# Altium project pfc-control-board.PrjPcb
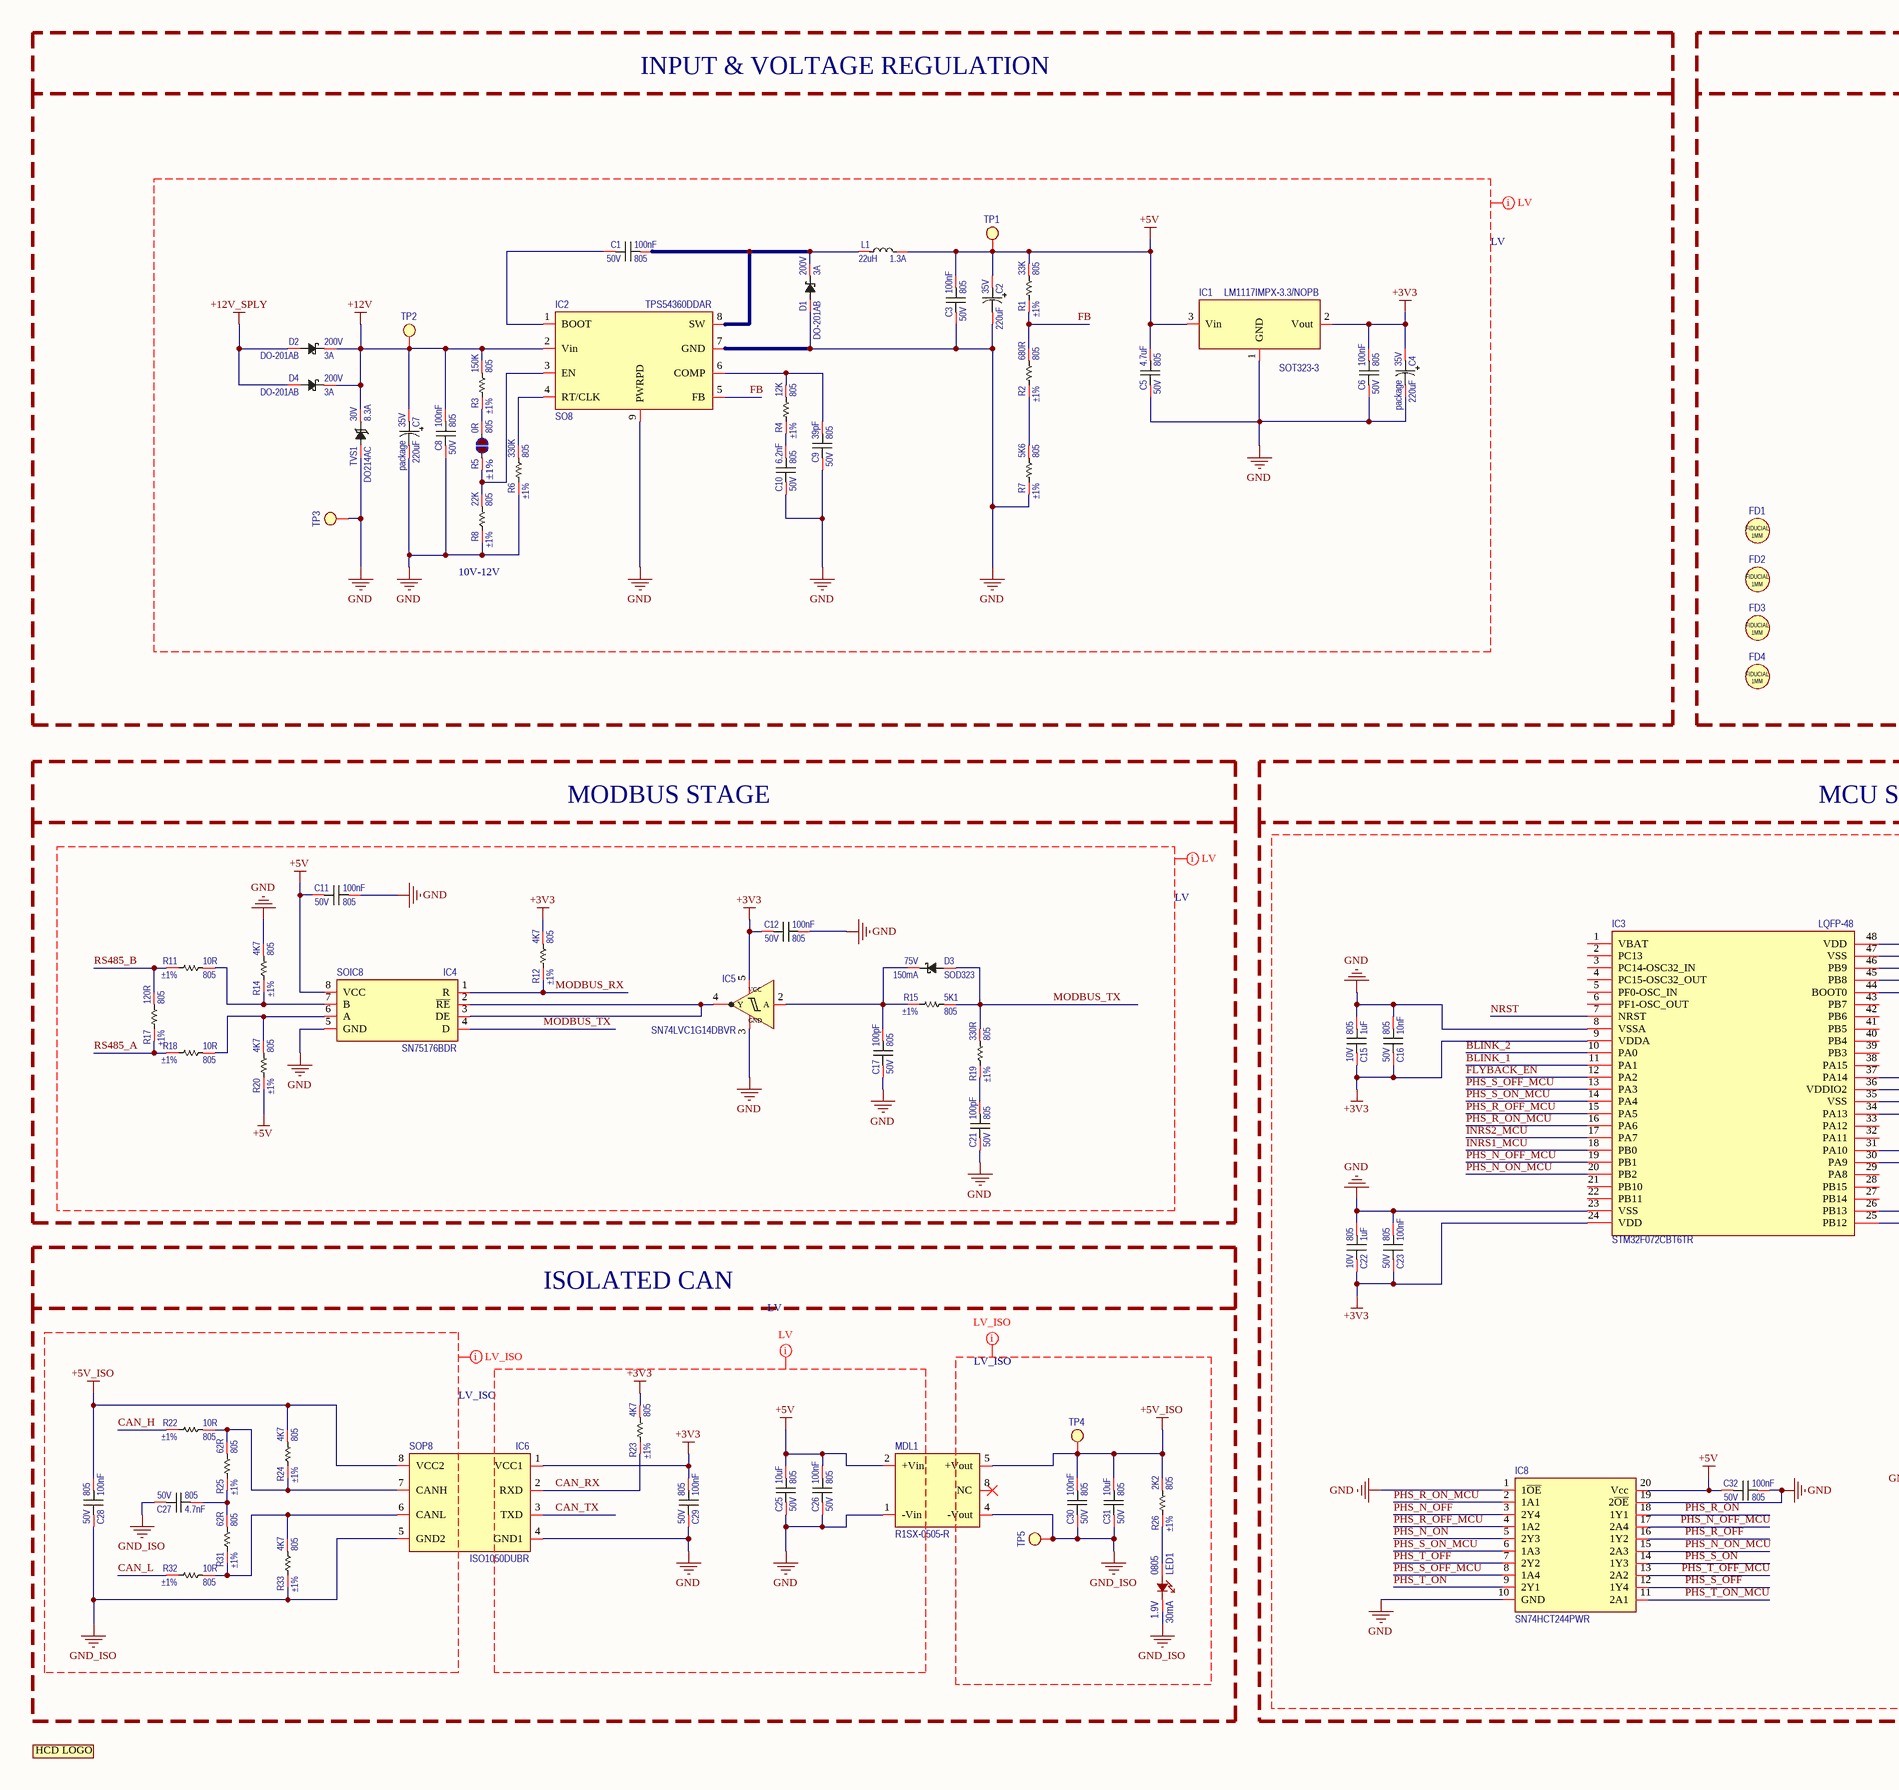
[diagram p0: pfc-control-board.SchDoc, left]
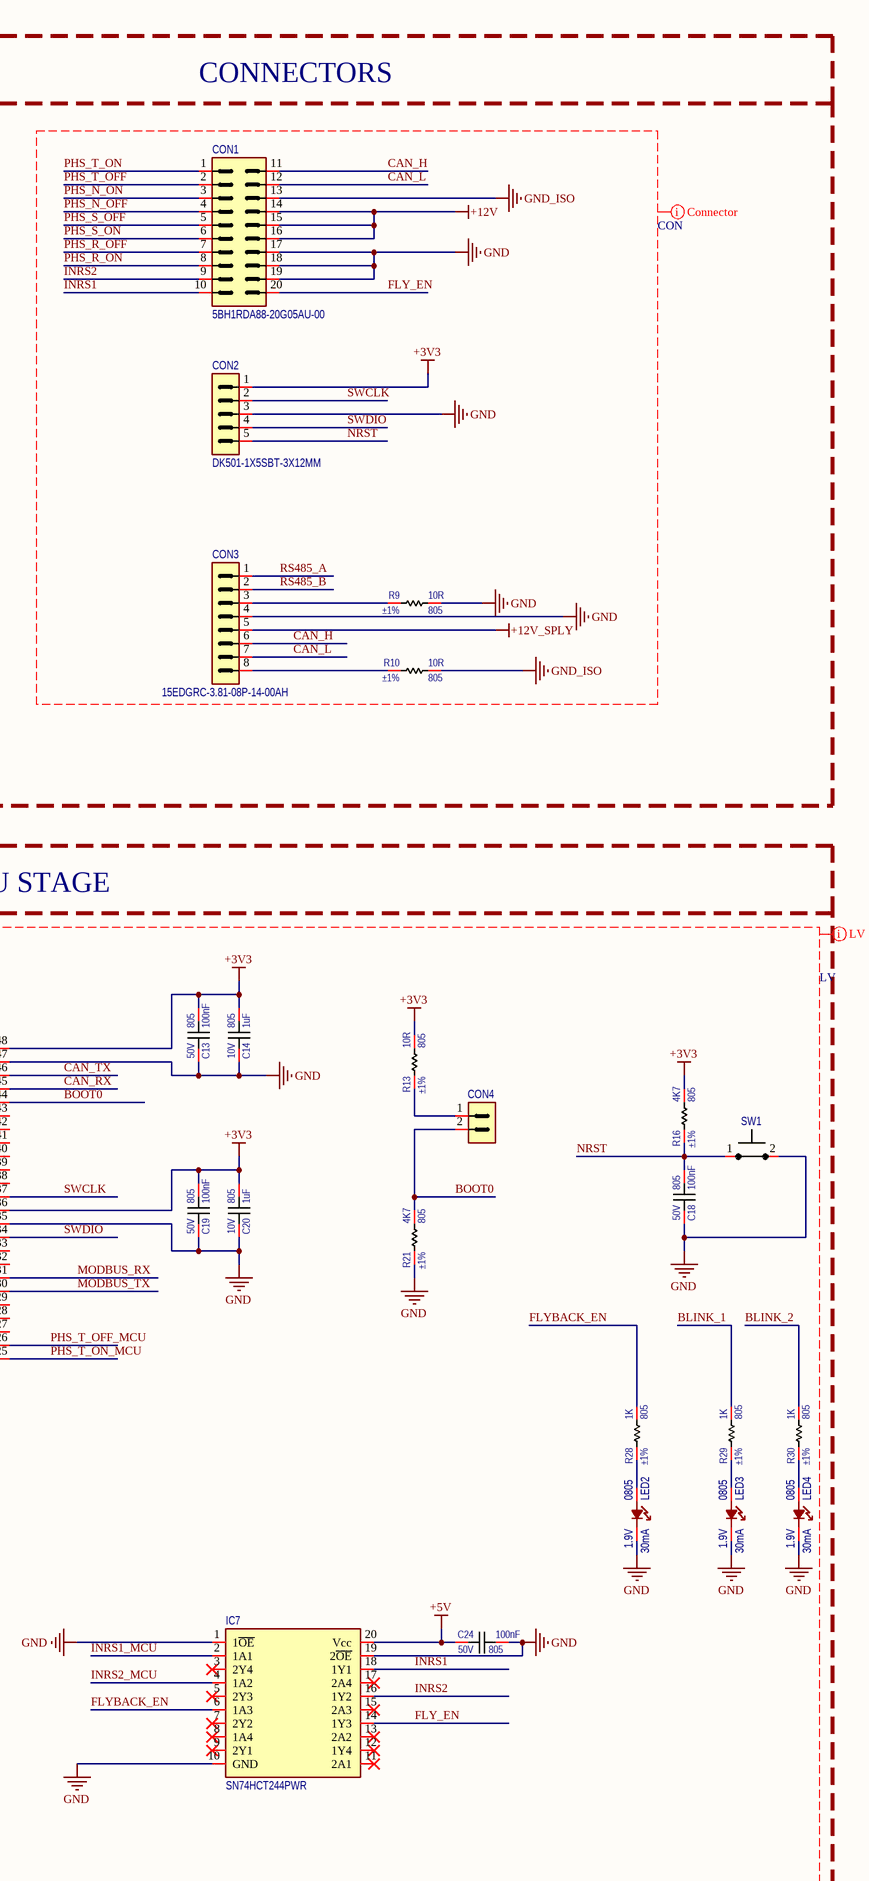
[diagram p1: pfc-control-board.SchDoc, right]
1 sheet, 98 parts. Net scope: global (net labels, ports and power ports of the same name join across sheets).
Board file: pfc-control-board.PcbDoc

## Sheet pfc-control-board.SchDoc
size A2; SheetNumber: 1; SheetTotal: 1

### Parts
C1  value 100nF  Voltage: 50V  Package: 805  [C_0805_L]  (hidden comment: StandardCapacitor)
C2  value 220uF  Voltage: 35V  [C_BDS35VC220MH10TP]  (hidden comment: PolarizedCapacitor)
C3  value 100nF  Voltage: 50V  Package: 805  [C_0805_L]  (hidden comment: StandardCapacitor)
C4  value 220uF  Voltage: 35V  [C_BDS35VC220MH10TP]  (hidden comment: PolarizedCapacitor)
C5  value 4.7uF  Voltage: 50V  Package: 805  [C_0805_L]  (hidden comment: StandardCapacitor)
C6  value 100nF  Voltage: 50V  Package: 805  [C_0805_L]  (hidden comment: StandardCapacitor)
C7  value 220uF  Voltage: 35V  [C_BDS35VC220MH10TP]  (hidden comment: PolarizedCapacitor)
C8  value 100nF  Voltage: 50V  Package: 805  [C_0805_L]  (hidden comment: StandardCapacitor)
C9  value 39pF  Voltage: 50V  Package: 805  [C_0805_L]  (hidden comment: StandardCapacitor)
C10  value 6.2nF  Voltage: 50V  Package: 805  [C_0805_L]  (hidden comment: StandardCapacitor)
C11  value 100nF  Voltage: 50V  Package: 805  [C_0805_L]  (hidden comment: StandardCapacitor)
C12  value 100nF  Voltage: 50V  Package: 805  [C_0805_L]  (hidden comment: StandardCapacitor)
C13  value 100nF  Voltage: 50V  Package: 805  [C_0805_L]  (hidden comment: StandardCapacitor)
C14  value 1uF  Voltage: 10V  Package: 805  [C_0805_L]  (hidden comment: StandardCapacitor)
C15  value 1uF  Voltage: 10V  Package: 805  [C_0805_L]  (hidden comment: StandardCapacitor)
C16  value 10nF  Voltage: 50V  Package: 805  [C_0805_L]  (hidden comment: StandardCapacitor)
C17  value 100pF  Voltage: 50V  Package: 805  [C_0805_L]  (hidden comment: StandardCapacitor)
C18  value 100nF  Voltage: 50V  Package: 805  [C_0805_L]  (hidden comment: StandardCapacitor)
C19  value 100nF  Voltage: 50V  Package: 805  [C_0805_L]  (hidden comment: StandardCapacitor)
C20  value 1uF  Voltage: 10V  Package: 805  [C_0805_L]  (hidden comment: StandardCapacitor)
C21  value 100pF  Voltage: 50V  Package: 805  [C_0805_L]  (hidden comment: StandardCapacitor)
C22  value 1uF  Voltage: 10V  Package: 805  [C_0805_L]  (hidden comment: StandardCapacitor)
C23  value 100nF  Voltage: 50V  Package: 805  [C_0805_L]  (hidden comment: StandardCapacitor)
C24  value 100nF  Voltage: 50V  Package: 805  [C_0805_L]  (hidden comment: StandardCapacitor)
C25  value 10uF  Voltage: 50V  Package: 805  [C_0805_L]  (hidden comment: StandardCapacitor)
C26  value 100nF  Voltage: 50V  Package: 805  [C_0805_L]  (hidden comment: StandardCapacitor)
C27  value 4.7nF  Voltage: 50V  Package: 805  [C_0805_L]  (hidden comment: StandardCapacitor)
C28  value 100nF  Voltage: 50V  Package: 805  [C_0805_L]  (hidden comment: StandardCapacitor)
C29  value 100nF  Voltage: 50V  Package: 805  [C_0805_L]  (hidden comment: StandardCapacitor)
C30  value 100nF  Voltage: 50V  Package: 805  [C_0805_L]  (hidden comment: StandardCapacitor)
C31  value 10uF  Voltage: 50V  Package: 805  [C_0805_L]  (hidden comment: StandardCapacitor)
C32  value 100nF  Voltage: 50V  Package: 805  [C_0805_L]  (hidden comment: StandardCapacitor)
CON1  Manufacturer PN: 5BH1RDA88-20G05AU-00  [male-thd-box-header-2x10-2.54mm-90D_AMTEK]  (hidden comment: CON_20POS_2R)
CON2  Manufacturer PN: DK501-1X5SBT-3X12MM  [male-thd-1x5-pin-header-2.54mm-180D]  (hidden comment: CON_5POS_1R)
CON3  Manufacturer PN: 15EDGRC-3.81-08P-14-00AH  [CON_15EDGRC-3.81-08P-14-00AH]  (hidden comment: CON_8POS_1R)
CON4  CON_2POS_1R  [male-thd-1x2-pin-header-2.54mm-90D]  (value not drawn)
D1  Voltage: 200V  Current: 3A  Package: DO-201AB  [D_DO214AB_ONSEMI]  (hidden comment: SchDiode_A1C2)
D2  Voltage: 200V  Current: 3A  Package: DO-201AB  [D_DO214AB_ONSEMI]  (hidden comment: SchDiode_A1C2)
D3  Voltage: 75V  Current: 150mA  Package: SOD323  [D_SOD323_HOTTECH]  (hidden comment: SchDiode_A1C2)
D4  Voltage: 200V  Current: 3A  Package: DO-201AB  [D_DO214AB_ONSEMI]  (hidden comment: SchDiode_A1C2)
FD1  (no value)  [FIDUCIAL_1MM]
FD2  (no value)  [FIDUCIAL_1MM]
FD3  (no value)  [FIDUCIAL_1MM]
FD4  (no value)  [FIDUCIAL_1MM]
IC1  Manufacturer PN: LM1117IMPX-3.3/NOPB  package: SOT323-3  [IC_SOT223_TEXAS]  (hidden comment: IC_LDO_LDL1117)
IC2  Manufacturer PN: TPS54360DDAR  Package: SO8  [IC_SO8_TEXAS]  (hidden comment: IC_SWREG_TPS54360DDAR)
IC3  Manufacturer PN: STM32F072CBT6TR  Package: LQFP-48  [IC_LQFP48_ST]  (hidden comment: IC_STM32F072CBT6TR)
IC4  Manufacturer PN: SN75176BDR  Package: SOIC8  [IC_SOIC8-D_TEXAS]  (hidden comment: IC_TR_SN75176BDR)
IC5  Manufacturer PN: SN74LVC1G14DBVR  [IC_SOT23-5_TEXAS]  (hidden comment: IC_BUF_NON_A2-3GND-4Y-5VCC)
IC6  Manufacturer PN: ISO1050DUBR  Package: SOP8  [IC_SOP8_TEXAS]  (hidden comment: IC_TR_ISO1050DUBR)
IC7  Manufacturer PN: SN74HCT244PWR  [IC_TSSOP20_TEXAS]  (hidden comment: IC_BUF_SN74HCT244PWR)
IC8  Manufacturer PN: SN74HCT244PWR  [IC_TSSOP20_TEXAS]  (hidden comment: IC_BUF_SN74HCT244PWR)
L1  value 22uH  Current: 1.3A  [IND_NR6028]  (hidden comment: StandardInductor)
LED1  Voltage: 1.9V  Current: 30mA  Package: 0805  [LED_0805]  (hidden comment: LED_RED)
LED2  Voltage: 1.9V  Current: 30mA  Package: 0805  [LED_0805]  (hidden comment: LED_RED)
LED3  Voltage: 1.9V  Current: 30mA  Package: 0805  [LED_0805]  (hidden comment: LED_RED)
LED4  Voltage: 1.9V  Current: 30mA  Package: 0805  [LED_0805]  (hidden comment: LED_RED)
LOGO1  HCD_LOGO  [HCD_LOGO_V1]  (value not drawn)  (no BOM)
MDL1  Manufacturer PN: R1SX-0505-R  [DCDC_R1SX-0505-R]  (hidden comment: DCDC_Module_Recom_R1SX)
R1  value 33K  Tolerance: ±1%  Package: 805  [R_0805_L]  (hidden comment: StandardResistor)
R2  value 680R  Tolerance: ±1%  Package: 805  [R_0805_L]  (hidden comment: StandardResistor)
R3  value 150K  Tolerance: ±1%  Package: 805  [R_0805_L]  (hidden comment: StandardResistor)
R4  value 12K  Tolerance: ±1%  Package: 805  [R_0805_L]  (hidden comment: StandardResistor)
R5  value 0R  Tolerance: ±1%  Package: 805  [R_0805_L]  (hidden comment: Jumper)
R6  value 330K  Tolerance: ±1%  Package: 805  [R_0805_L]  (hidden comment: StandardResistor)
R7  value 5K6  Tolerance: ±1%  Package: 805  [R_0805_L]  (hidden comment: StandardResistor)
R8  value 22K  Tolerance: ±1%  Package: 805  [R_0805_L]  (hidden comment: StandardResistor)
R9  value 10R  Tolerance: ±1%  Package: 805  [R_0805_L]  (hidden comment: StandardResistor)
R10  value 10R  Tolerance: ±1%  Package: 805  [R_0805_L]  (hidden comment: StandardResistor)
R11  value 10R  Tolerance: ±1%  Package: 805  [R_0805_L]  (hidden comment: StandardResistor)
R12  value 4K7  Tolerance: ±1%  Package: 805  [R_0805_L]  (hidden comment: StandardResistor)
R13  value 10R  Tolerance: ±1%  Package: 805  [R_0805_L]  (hidden comment: StandardResistor)
R14  value 4K7  Tolerance: ±1%  Package: 805  [R_0805_L]  (hidden comment: StandardResistor)
R15  value 5K1  Tolerance: ±1%  Package: 805  [R_0805_L]  (hidden comment: StandardResistor)
R16  value 4K7  Tolerance: ±1%  Package: 805  [R_0805_L]  (hidden comment: StandardResistor)
R17  value 120R  Tolerance: ±1%  Package: 805  [R_0805_L]  (hidden comment: StandardResistor)
R18  value 10R  Tolerance: ±1%  Package: 805  [R_0805_L]  (hidden comment: StandardResistor)
R19  value 330R  Tolerance: ±1%  Package: 805  [R_0805_L]  (hidden comment: StandardResistor)
R20  value 4K7  Tolerance: ±1%  Package: 805  [R_0805_L]  (hidden comment: StandardResistor)
R21  value 4K7  Tolerance: ±1%  Package: 805  [R_0805_L]  (hidden comment: StandardResistor)
R22  value 10R  Tolerance: ±1%  Package: 805  [R_0805_L]  (hidden comment: StandardResistor)
R23  value 4K7  Tolerance: ±1%  Package: 805  [R_0805_L]  (hidden comment: StandardResistor)
R24  value 4K7  Tolerance: ±1%  Package: 805  [R_0805_L]  (hidden comment: StandardResistor)
R25  value 62R  Tolerance: ±1%  Package: 805  [R_0805_L]  (hidden comment: StandardResistor)
R26  value 2K2  Tolerance: ±1%  Package: 805  [R_0805_L]  (hidden comment: StandardResistor)
R28  value 1K  Tolerance: ±1%  Package: 805  [R_0805_L]  (hidden comment: StandardResistor)
R29  value 1K  Tolerance: ±1%  Package: 805  [R_0805_L]  (hidden comment: StandardResistor)
R30  value 1K  Tolerance: ±1%  Package: 805  [R_0805_L]  (hidden comment: StandardResistor)
R31  value 62R  Tolerance: ±1%  Package: 805  [R_0805_L]  (hidden comment: StandardResistor)
R32  value 10R  Tolerance: ±1%  Package: 805  [R_0805_L]  (hidden comment: StandardResistor)
R33  value 4K7  Tolerance: ±1%  Package: 805  [R_0805_L]  (hidden comment: StandardResistor)
SW1  BUTTON_2PIN  [BUTTON_DTSMF-31R-V_DIPTRONICS]  (value not drawn)
TP1  (no value)  [TP_SMD_CIRC_D1.0]
TP2  (no value)  [TP_SMD_CIRC_D1.0]
TP3  (no value)  [TP_SMD_CIRC_D1.0]
TP4  (no value)  [TP_SMD_CIRC_D1.0]
TP5  (no value)  [TP_SMD_CIRC_D1.0]
TVS1  Voltage: 30V  Current: 8.3A  Package: DO214AC  [TVS_SMA_PANJIT]  (hidden comment: TVSDiodeUnidir_A1C2)

### Blocks framed on the sheet
INPUT & VOLTAGE REGULATION: C1-C10 D1 D2 D4 IC1 IC2 L1 R1-R8 TP1-TP3 TVS1
CONNECTORS: CON1-CON3 FD1-FD4 R9 R10
MODBUS STAGE: C11 C12 C17 C21 D3 IC4 IC5 R11 R12 R14 R15 R17-R20
MCU STAGE: C13-C16 C18-C20 C22-C24 C32 CON4 IC3 IC7 IC8 LED2-LED4 R13 R16 R21 R28-R30 SW1
ISOLATED CAN: C25-C31 IC6 LED1 MDL1 R22-R26 R31-R33 TP4 TP5

### Nets
+3V3: C4.1 C6.2 C12.1 C13.2 C14.2 C15.1 C16.1 C19.2 C20.2 C22.1 C23.1 C29.2 CON2.1 IC1.2(Vout) IC3.9(VDDA) IC3.24(VDD) IC3.36(VDDIO2) IC3.48(VDD) IC5.5(VCC) IC6.1(VCC1) R12.2 R13.2 R16.2 R23.2
+5V: C2.1 C3.2 C5.2 C11.1 C24.1 C25.2 C26.2 C32.1 IC1.3(Vin) IC4.8(VCC) IC7.20(Vcc) IC8.20(Vcc) L1.2 MDL1.2(+Vin) R1.2 R20.1 TP1.1
+5V_ISO: C28.2 C30.2 C31.2 IC6.8(VCC2) MDL1.5(+Vout) R24.2 R26.2 TP4.1
+12V: C7.1 C8.2 CON1.14 CON1.15 CON1.16 D2.2(C) D4.2(C) IC2.2(Vin) R3.2 TP2.1 TVS1.2(C)
+12V_SPLY: CON3.5 D2.1(A) D4.1(A)
GND: C2.2 C3.1 C4.2 C5.1 C6.1 C7.2 C8.1 C9.1 C10.1 C11.2 C12.2 C13.1 C14.1 C15.2 C16.2 C17.1 C18.1 C19.1 C20.1 C21.1 C22.2 C23.2 C24.2 C25.1 C26.1 C29.1 C32.2 CON1.17 CON1.18 CON1.19 CON2.3 CON3.4 D1.1(A) IC1.1(GND) IC2.7(GND) IC2.9(PWRPD) IC3.8(VSSA) IC3.23(VSS) IC3.35(VSS) IC3.47(VSS) IC4.5(GND) IC5.3(GND) IC6.4(GND1) IC7.1(1~{OE}) IC7.10(GND) IC7.19(2~{OE}) IC8.1(1~{OE}) IC8.10(GND) IC8.19(2~{OE}) LED2.2(C) LED3.2(C) LED4.2(C) MDL1.1(-Vin) R6.1 R7.1 R8.1 R9.2 R14.2 R21.1 SW1.2 TP3.1 TVS1.1(A)
GND_ISO: C27.1 C28.1 C30.1 C31.1 CON1.13 IC6.5(GND2) LED1.2(C) MDL1.4(-Vout) R10.2 R33.1 TP5.1
BLINK_1: IC3.11(PA1) R29.2
BLINK_2: IC3.10(PA0) R30.2
BOOT0: CON4.2 IC3.44(BOOT0) R21.2
CAN_H: CON1.11 CON3.6 R22.1
CAN_L: CON1.12 CON3.7 R32.1
CAN_RX: IC3.45(PB8) IC6.2(RXD) R23.1
CAN_TX: IC3.46(PB9) IC6.3(TXD)
FB: IC2.5(FB) R1.1 R2.2
FLY_EN: CON1.20 IC7.14(1Y3)
FLYBACK_EN: IC3.12(PA2) IC7.6(1A3) R28.2
INRS1: CON1.10 IC7.18(1Y1)
INRS1_MCU: IC3.18(PB0) IC7.2(1A1)
INRS2: CON1.9 IC7.16(1Y2)
INRS2_MCU: IC3.17(PA7) IC7.4(1A2)
MODBUS_RX: IC3.31(PA10) IC4.1(R) R12.1
MODBUS_TX: D3.1(A) IC3.30(PA9) IC4.4(D) R15.2 R19.2
NRST: C18.2 CON2.5 IC3.7(NRST) R16.1 SW1.1
PHS_N_OFF: CON1.4 IC8.3(2Y4)
PHS_N_OFF_MCU: IC3.19(PB1) IC8.17(2A4)
PHS_N_ON: CON1.3 IC8.5(2Y3)
PHS_N_ON_MCU: IC3.20(PB2) IC8.15(2A3)
PHS_R_OFF: CON1.7 IC8.16(1Y2)
PHS_R_OFF_MCU: IC3.15(PA5) IC8.4(1A2)
PHS_R_ON: CON1.8 IC8.18(1Y1)
PHS_R_ON_MCU: IC3.16(PA6) IC8.2(1A1)
PHS_S_OFF: CON1.5 IC8.12(1Y4)
PHS_S_OFF_MCU: IC3.13(PA3) IC8.8(1A4)
PHS_S_ON: CON1.6 IC8.14(1Y3)
PHS_S_ON_MCU: IC3.14(PA4) IC8.6(1A3)
PHS_T_OFF: CON1.2 IC8.7(2Y2)
PHS_T_OFF_MCU: IC3.26(PB13) IC8.13(2A2)
PHS_T_ON: CON1.1 IC8.9(2Y1)
PHS_T_ON_MCU: IC3.25(PB12) IC8.11(2A1)
RS485_A: CON3.1 R17.1 R18.1
RS485_B: CON3.2 R11.1 R17.2
SWCLK: CON2.2 IC3.37(PA14)
SWDIO: CON2.4 IC3.34(PA13)
NetC1_1: C1.1 IC2.1(BOOT)
NetC1_2: C1.2 D1.2(C) IC2.8(SW) L1.1
NetC9_2: C9.2 IC2.6(COMP) R4.2
NetC10_2: C10.2 R4.1
NetC17_2: C17.2 D3.2(C) IC5.2(A) R15.1
NetC21_2: C21.2 R19.1
NetC27_2: C27.2 R25.1 R31.2
NetCON3_3: CON3.3 R9.1
NetCON3_8: CON3.8 R10.1
NetCON4_1: CON4.1 R13.1
NetIC2_3: IC2.3(EN) R5.1 R8.2
NetIC2_4: IC2.4(RT/CLK) R6.2
NetIC4_2: IC4.2(~{RE}) IC4.3(DE) IC5.4(Y)
NetIC4_6: IC4.6(A) R18.2 R20.2
NetIC4_7: IC4.7(B) R11.2 R14.1
NetIC6_6: IC6.6(CANL) R31.1 R32.2 R33.2
NetIC6_7: IC6.7(CANH) R22.2 R24.1 R25.2
NetLED1_1: LED1.1(A) R26.1
NetLED2_1: LED2.1(A) R28.1
NetLED3_1: LED3.1(A) R29.1
NetLED4_1: LED4.1(A) R30.1
NetR2_1: R2.1 R7.2
NetR3_1: R3.1 R5.2

Not connected (* = marked no-connect by the designer): IC3 1(VBAT) 2(PC13) 3(PC14-OSC32_IN) 4(PC15-OSC32_OUT) 5(PF0-OSC_IN) 6(PF1-OSC_OUT) 21(PB10) 22(PB11) 27(PB14) 28(PB15) 29(PA8) 32(PA11) 33(PA12) 38(PA15) 39(PB3) 40(PB4) 41(PB5) 42(PB6) 43(PB7); IC7 3(2Y4)* 5(2Y3)* 7(2Y2)* 8(1A4)* 9(2Y1)* 11(2A1)* 12(1Y4)* 13(2A2)* 15(2A3)* 17(2A4)*; MDL1 8(NC)*

### Layout directives
net class LV_ISO: +5V_ISO, CAN_H, CAN_L, GND_ISO
net class LV: +3V3, +5V, +12V, +12V_SPLY, BLINK_1, BLINK_2, BOOT0, CAN_RX, CAN_TX, FB, FLY_EN, FLYBACK_EN, GND, INRS1, INRS1_MCU, INRS2, INRS2_MCU, MODBUS_RX, MODBUS_TX, NRST, PHS_N_OFF, PHS_N_OFF_MCU, PHS_N_ON, PHS_N_ON_MCU, PHS_R_OFF, PHS_R_OFF_MCU, PHS_R_ON, PHS_R_ON_MCU, PHS_S_OFF, PHS_S_OFF_MCU, PHS_S_ON, PHS_S_ON_MCU, PHS_T_OFF, PHS_T_OFF_MCU, PHS_T_ON, PHS_T_ON_MCU, RS485_A, RS485_B, SWCLK, SWDIO
net class CON: +3V3, +12V, +12V_SPLY, CAN_H, CAN_L, FLY_EN, GND, GND_ISO, INRS1, INRS2, NRST, PHS_N_OFF, PHS_N_ON, PHS_R_OFF, PHS_R_ON, PHS_S_OFF, PHS_S_ON, PHS_T_OFF, PHS_T_ON, RS485_A, RS485_B, SWCLK, SWDIO

### Notes on the sheet
- (near R8) 10V-12V
- (in symbol 1MM_FIDUCIAL) FIDUCIAL; 1MM
- (in symbol HCD_LOGO_V1) HCD LOGO

### Library data of the parts
C1 C3 C6 C8 C11-C13 C18 C19 C23 C24 C26 C28-C30 C32 = CAP_CER_100nF_SMD_50V_±20%_0805: 0.1 µF ±20% 50V Ceramic Capacitor X7R 0805 (2012 Metric); Manufacturer: KEMET; Manufacturer PN: C0805C104M5RAC7800; Lead Status: ROHS3 Compliant; Temp# Operating: -55/+125°C; Max Reflow Duration: 10s; Max Reflow Temp: 260C; Identifier: CAP_CER_100nF_SMD_50V_±20%_0805; Component Type: Ceramic Capacitor; Distributor: Digikey; Tolerance: ±20%; MSL: 1; Features: X7R; Mounting Type: SMD; Status: Active; Height: 0.88mm; Cost: 0,1; Supplier URL: https://www.digikey.com/en/products/detail/kemet/C0805C104M5RAC7800/411168
C2 C4 C7 = CAP_ALUM_ELK_220uF_SMD_35V_±20%: CAP.EL.220uF 35V 8x10 105C 2000Hrs SMD; Manufacturer: SAMYOUNG; Manufacturer PN: BDS35VC220MH10TP; Tolerance: ±20%; Lead Status: ROHS3 Compliant; Temp# Operating: -40/+105°C; Max Reflow Duration: 10s; Max Reflow Temp: 260C; Identifier: CAP_ALUM_ELK_220uF_SMD_35V_±20%; Component Type: Aluminum Capacitor; Distributor: Özdisan; Status: Active; Height: 10mm; Cost: 0,14; MSL: 1; Mounting Type: SMD; Supplier URL: https://ozdisan.com/pasif-komponentler/kapasitorler/aluminyum-kapasitorler/BDS35VC220MH10TP/455406
  C4 C7: Package: package
C5 = CAP_CER_4.7uF_SMD_50V_±10%_0805: 4.7 µF ±10% 50V Ceramic Capacitor X7R 0805 (2012 Metric); Manufacturer: TDK Corporation; Manufacturer PN: C2012X7R1H475K125AC; Lead Status: ROHS3 Compliant; Temp# Operating: -55/+125°C; Max Reflow Duration: 10s; Max Reflow Temp: 260C; Identifier: CAP_CER_4.7uF_SMD_50V_±10%_0805; Component Type: Ceramic Capacitor; Distributor: Digikey; Tolerance: ±10%; MSL: 1; Features: X7R; Mounting Type: SMD; Status: Active; Height: 1.5mm; Cost: 0,54; Supplier URL: https://www.digikey.com/en/products/detail/tdk-corporation/C2012X7R1H475K125AC/10413507
C9 = CAP_CER_39pF_SMD_50V_±5%_0805: 39 pF ±5% 50V Ceramic Capacitor C0G, NP0 0805 (2012 Metric); Manufacturer: YAGEO; Manufacturer PN: CC0805JRNPO9BN390; Lead Status: ROHS3 Compliant; Temp# Operating: -55/+125°C; Max Reflow Duration: 10s; Max Reflow Temp: 260C; Identifier: CAP_CER_39pF_SMD_50V_±5%_0805; Component Type: Ceramic Capacitor; Distributor: Digikey; Tolerance: ±5%; MSL: 1; Features: General purpose; Mounting Type: SMD; Status: Active; Height: 2mm; Cost: 0,1; Supplier URL: https://www.digikey.com/en/products/detail/yageo/CC0805JRNPO9BN390/302840
C10 = CAP_CER_6.2nF_SMD_50V_±5%_0805: 6200 pF ±5% 50V Ceramic Capacitor C0G, NP0 0805 (2012 Metric); Manufacturer: KEMET; Manufacturer PN: C0805C622J5GACTU; Lead Status: ROHS3 Compliant; Temp# Operating: -55/+125°C; Max Reflow Duration: 10s; Max Reflow Temp: 260C; Identifier: CAP_CER_6.2nF_SMD_50V_±5%_0805; Component Type: Ceramic Capacitor; Distributor: Digikey; Status: Active; Tolerance: ±5%; Height: 0,88mm; Cost: 0,211; MSL: 1; Mounting Type: SMD; Features: Low ESL, general purpose; Supplier URL: https://www.digikey.com/en/products/detail/kemet/C0805C622J5GACTU/7382176
C14 C15 C20 C22 = CAP_CER_1uF_SMD_10V_±10%_0805: 1 µF ±10% 10V Ceramic Capacitor X7R 0603 (1608 Metric); Manufacturer: Samsung Electro-Mechanics; Manufacturer PN: CL10B105KP8NNNC; Lead Status: ROHS3 Compliant; Temp# Operating: -55/+125°C; Max Reflow Duration: 10s; Max Reflow Temp: 260C; Identifier: CAP_CER_1uF_SMD_10V_±10%_0805; Component Type: Ceramic Capacitor; Distributor: Digikey; Tolerance: ±10%; MSL: 1; Features: X7R; Mounting Type: SMD; Status: Active; Height: 0.9mm; Cost: 0,1; Supplier URL: https://www.digikey.com/en/products/detail/samsung-electro-mechanics/CL10B105KP8NNNC/3887604
C16 = CAP_CER_10nF_SMD_50V_±5%_0805: 10000 pF ±5% 50V Ceramic Capacitor X7R 0805 (2012 Metric); Manufacturer: KEMET; Manufacturer PN: C0805C103J5RAC7210; Lead Status: ROHS3 Compliant; Temp# Operating: -55/+125°C; Max Reflow Duration: 10s; Max Reflow Temp: 260C; Identifier: CAP_CER_10nF_SMD_50V_±5%_0805; Component Type: Ceramic Capacitor; Distributor: Digikey; Tolerance: ±5 %; MSL: 1; Features: X7R; Mounting Type: SMD; Status: Active; Height: 0.88mm; Cost: 0,1; Supplier URL: https://www.digikey.com/en/products/detail/kemet/C0805C103J5RAC7210/8572451
C17 C21 = CAP_CER_100pF_SMD_50V_±1%_0805: 100 pF ±1% 50V Ceramic Capacitor C0G, NP0 0805 (2012 Metric); Manufacturer: KEMET; Manufacturer PN: C0805C101F5GAC7800; Lead Status: ROHS3 Compliant; Temp# Operating: -55/+125°C; Max Reflow Duration: 10s; Max Reflow Temp: 260C; Identifier: CAP_CER_100pF_SMD_50V_±1%_0805; Component Type: Ceramic Capacitor; Distributor: Digikey; Tolerance: ±1%; MSL: 1; Mounting Type: SMD; Status: Active; Height: 0.75mm; Cost: 0,84; Supplier URL: https://www.digikey.com/en/products/detail/kemet/C0805C101F5GAC7800/2211630
C25 C31 = CAP_CER_10uF_SMD_50V_±10%_0805: 10 µF ±10% 50V Ceramic Capacitor X5R 0805 (2012 Metric); Manufacturer: Murata Electronics; Manufacturer PN: GRM21BR61H106KE43L; Lead Status: ROHS3 Compliant; Temp# Operating: -55/+85°C; Max Reflow Duration: 10s; Max Reflow Temp: 260C; Identifier: CAP_CER_10uF_SMD_50V_±10%_0805; Component Type: Ceramic Capacitor; Distributor: Digikey; Tolerance: ±10%; MSL: 1; Features: X7R; Mounting Type: SMD; Status: Active; Height: 1.25mm; Cost: 0,34; Supplier URL: https://www.digikey.com/en/products/detail/murata-electronics/GRM21BR61H106KE43L/10326316
C27 = CAP_CER_4.7nF_SMD_50V_±10%_0805: 4700 pF ±10% 50V Ceramic Capacitor X7R 0805 (2012 Metric); Manufacturer: KEMET; Manufacturer PN: C0805C472K5RAC7800; Lead Status: ROHS3 Compliant; Temp# Operating: -55/+125°C; Max Reflow Duration: 10s; Max Reflow Temp: 260C; Identifier: CAP_CER_4.7nF_SMD_50V_±10%_0805; Component Type: Ceramic Capacitor; Distributor: Digikey; Tolerance: ±10%; MSL: 1; Features: X7R; Mounting Type: SMD; Status: Active; Height: 0.88mm; Cost: 0,1; Supplier URL: https://www.digikey.com/en/products/detail/kemet/C0805C472K5RAC7800/411154
CON1 = CONN_MALE_BXHDR_20POS_2R_2.54MM_THD_90D_5BH1RDA88-20G05AU-00: BOX HEADER 20PIN(2x10) 2.54mm THT R/A MALE BLACK; Manufacturer: AMTEK; Voltage: 1000V AC; Current: 3A; Temp# Operating: -45°C ~ 105°C; Lead Status: ROHS3 Compliant; Max Reflow Duration: 10s; Max Reflow Temp: 260C; Identifier: CONN_MALE_BXHDR_20POS_2R_2.54MM_THD_90D_5BH1RDA88-20G05AU-00; Component Type: Box Header; Distributor: Özdisan; Height: 10.32mm; MSL: 1; Features: Flat kablo konnektörü; Mounting Type: THD; Supplier URL: https://www.ozdisan.com/konnektor-ve-baglanti-elemanlari/header-konnektorler/box-headerlar/5BH1RDA88-20G05AU-00/485576
CON2 = PINHDR_MALE_HEADER_5POS_1R_2.54mm_THD_180D: PIN HEADER 5PIN(1x5) 2.54mm THT V/T 3X12MM; Manufacturer: DENK-ELEC; Voltage: 1000V AC; Current: 2A; Temp# Operating: -40°C ~ 105°C; Lead Status: ROHS3 Compliant; Max Reflow Duration: 6s; Max Reflow Temp: 260C; Identifier: PINHDR_MALE_HEADER_5POS_1R_2.54mm_THD_180D; Component Type: Pin Header; Distributor: Özdisan; Height: N/A; MSL: 1; Features: Pin Header; Mounting Type: THD; Package: 2,54mm; Tolerance: N/A; Supplier URL: https://ozdisan.com/konnektor-ve-baglanti-elemanlari/header-konnektorler/pin-headerlar/DK501-1X5SBT-3X12MM/649038
CON3 = KLEMENS_PLG-IN_MALE_8POS_1R_3.81mm_THD_90D_15EDGRC-3.81-08P-14-00AH: TERM.BLK.3.81MM 8P 90C MALE GREEN CLOSED; Manufacturer: DEGSON; Voltage: 300V; Current: 8A; Temp# Operating: -40°C ~ 105°C; Lead Status: ROHS3 Compliant; Max Reflow Duration: 10s; Max Reflow Temp: 260C; Identifier: KLEMENS_PLG-IN_MALE_8POS_1R_3.81mm_THD_90D_15EDGRC-3.81-08P-14-00AH; Component Type: Klemens; Distributor: Özdisan; Height: 9.2mm; Temp# Storage: N/A; MSL: 1; Features: Geçmeli klemens; Mounting Type: THD; Supplier URL: https://ozdisan.com/konnektor-ve-baglanti-elemanlari/klemensler/gecmeli-klemensler/15EDGRC-3-81-08P-14-00AH
CON4 = PINHDR_MALE_HEADER_2POS_1R_2.54mm_THD_90D: PIN HEADER 2PIN(1x2) 2.54mm THT R/A 6X3X4.5MM; Manufacturer PN: 5PH1RUA25-102G0NNBL6X3X4; Manufacturer: AMTEK; Voltage: 500V AC; Temp# Operating: -40°C ~ 105°C; Lead Status: ROHS3 Compliant; Max Reflow Duration: 10s; Max Reflow Temp: 260C; Identifier: PINHDR_MALE_HEADER_2POS_1R_2.54mm_THD_90D; Component Type: Pin Header; Distributor: Özdisan; MSL: 1; Features: Pin Header; Mounting Type: THD; Tolerance: N/A; Supplier URL: https://ozdisan.com/konnektor-ve-baglanti-elemanlari/header-konnektorler/pin-headerlar/5PH1RUA25-102G0NNBL6X3X4/959033
D1 D2 D4 = SCH_DIODE_200V_3A_SMD_DO201AB_ES3D: DIODE FAST RECOVERY Single 3A 200V DO214AB (SMC); Manufacturer PN: ES3D; Manufacturer: ONS (FAIRCHILD); Temp# Operating: -50°C ~ 150°C; Temp# Storage: -50°C/+150°C; Lead Status: ROHS Compliant; Max Reflow Duration: 10s; Max Reflow Temp: 260C; Value: value; Identifier: SCH_DIODE_200V_3A_SMD_DO201AB_ES3D; Component Type: Diode, Schottky; Distributor: Özdisan; Height: 2.65mm; MSL: 1; Cost: 0,3; Features: Schottky Diode; Mounting Type: SMD; Supplier URL: https://ozdisan.com/guc-yari-iletkenleri/diyotlar-modul-diyotlar-ve-dogrultucular/genel-amacli-diyotlar/ES3D
D3 = SCH_DIODE_60V_150MA_SMD_SOD323_1N4148WS-HT: DIODE FAST SWITCHING Single 150mA 75V SMT SOD323; Manufacturer: HOTTECH; Temp# Operating: -65°C/+150°C; Lead Status: ROHS Compliant; Max Reflow Duration: 10s; Max Reflow Temp: 260C; Value: value; Identifier: SCH_DIODE_60V_150MA_SMD_SOD323_1N4148WS-HT; Component Type: Diode, Schottky; Distributor: Özdisan; Manufacturer PN: 1N4148WS-HT; Height: N/A; Temp# Storage: -65°C/+150°C; MSL: 1; Cost: 0,0058; Features: Schottky Diode; Mounting Type: SMD; Supplier URL: https://www.ozdisan.com/p/General-Purpose-Diodes-389/hottech-1n4148ws-ht-453557
FD1-FD4 = 1MM_FIDUCIAL: Fiducial 1mm; Approve: OK; Identifier: 1MM_FIDUCIAL; Component Type: Fiducial; Distributor: N/A; Lead Status: N/A; MSL: N/A; Features: N/A; Mounting Type: SMD; Package: FIDUCIAL_1mm
IC1 = IC_LDO_REG_3V3_0.8A_SOT323-3_LM1117IMPX-3.3/NOPB: IC REG LIN 3.3V 800MA SOT223-4; Manufacturer: Texas Instruments; Temp# Operating: -40°C/+125°C; Lead Status: ROHS3 Compliant; Max Reflow Duration: 10s; Max Reflow Temp: 260C; Voltage: 15V to 20V; Current: 0.8A; Temp# Storage: -65°C/+150°C; Identifier: IC_LDO_REG_3V3_0.8A_SOT323-3_LM1117IMPX-3.3/NOPB; Component Type: Linear Regulator; Distributor: Özdisan; Height: 1.8mm; MSL: 1; Cost: 1,04; Mounting Type: SMD; Status: Active; Tolerance: N/A; Features: LDO; Supplier URL: https://ozdisan.com/entegre-devreler-icler/guc-entegreleri/lineer-voltaj-regulatorleri/LM1117IMPX-3-3NOPB/588247
IC2 = IC_BUCK_SW_ADJ_REG_SO8_TPS54360DDAR: IC-54360 REG BUCK SPLIT RAIL 8SOPWRPAD; Manufacturer: Texas Instruments; Temp# Operating: -40°C/+150°C; Lead Status: ROHS3 Compliant; Max Reflow Duration: 10s; Max Reflow Temp: 260C; Voltage: 4V5 to 60V; Current: 3.5A; Temp# Storage: -65°C/+150°C; Identifier: IC_BUCK_SW_ADJ_REG_SO8_TPS54360DDAR; Component Type: Switching Regulator; Distributor: Özdisan; Height: 1.7mm; MSL: 2; Cost: 2,51; Mounting Type: SMD; Status: Active; Tolerance: N/A; Features: Buck; Supplier URL: https://ozdisan.com/entegre-devreler-icler/guc-entegreleri/dc-dc-voltaj-regulatorleri/TPS54360DDAR/600353
IC3 = IC_MCU_32BIT_48MHZ_LQFP48_STM32F072CBT6TR_ST: IC-32F072C MCU 32BIT 128KB FLASH 48LQFP; Manufacturer: STMicroelectronics; Temp# Operating: -40°C/+85°C; Lead Status: ROHS3 Compliant; Max Reflow Duration: 10s; Max Reflow Temp: 260C; Voltage: -0.3V to 4V; Current: -25mA to 25mA; Temp# Storage: -65°C/+150°C; Identifier: IC_MCU_32BIT_48MHZ_LQFP48_STM32F072CBT6TR_ST; Component Type: MCU; Distributor: Özdisan; Height: 1.6mm; MSL: 1; Cost: 5,589; Mounting Type: SMD; Status: Active; Tolerance: N/A; Features: STM32; Supplier URL: https://www.ozdisan.com/entegre-devreler-icler/embedded-entegreler/mikroislemciler/STM32F072CBT6TR/491492
IC4 = IC_TRNSCVR_RS485_SOIC8_SN75176BDR: IC-75176 RS485 DRIVER SMD SO8 TR TI; Manufacturer: Texas Instruments; Temp# Operating: 0°C/+70°C; Lead Status: ROHS3 Compliant; Max Reflow Duration: 10s; Max Reflow Temp: 260; Voltage: 0V to 7V; Current: -60mA to 60mA; Temp# Storage: -65°C/+150°C; Identifier: IC_TRNSCVR_RS485_SOIC8_SN75176BDR; Component Type: Transceiver; Distributor: Digikey; Height: 1.75mm; MSL: 1; Cost: 0,16; Mounting Type: SMD; Status: Active; Tolerance: N/A; Features: Differential Bus Transceivers; Supplier URL: https://www.digikey.com/en/products/detail/texas-instruments/SN75176BDR/276918
IC5 = IC_BF_INV_SCHTRG_SINGLE_SN74LVC1G14DBVR: IC-74LVC14 BUFFER SCHMIT TRIG SOT23-5 SMD; Manufacturer: Texas Instruments; Temp# Operating: -40°C/+85°C; Lead Status: ROHS3 Compliant; Max Reflow Duration: 10s; Max Reflow Temp: 260C; Voltage: -0V5 to 6V5; Current: -50mA to 50mA; Temp# Storage: -65°C/+150°C; Identifier: IC_BF_INV_SCHTRG_SINGLE_SN74LVC1G14DBVR; Component Type: Buffer; Distributor: Özdisan; Height: 1.1mm; MSL: 1; Cost: 0,11; Mounting Type: SMD; Package: SOT23-5; Status: Active; Tolerance: N/A; Features: Single Schmitt-Trigger Inverter; Supplier URL: https://ozdisan.com/entegre-devreler-icler/logic-entegreler/logic-kapi-ve-cevirici-entegreleri/SN74LVC1G14DBVR/453364
IC6 = IC_TRNSCVR_ISOLATED_CAN_SOP8_ISO1050DUBR: IC-1050DUBR ISOLATED CAN TRANSCEIVER SOP8 SMD TI; Manufacturer: Texas Instruments; Temp# Operating: -55°C/+105°C; Lead Status: ROHS3 Compliant; Max Reflow Duration: 10s; Max Reflow Temp: 260; Voltage: -0V5 to 6V; Current: -15mA to 15mA; Temp# Storage: -65°C/+150°C; Identifier: IC_TRNSCVR_ISOLATED_CAN_SOP8_ISO1050DUBR; Component Type: Transceiver; Distributor: Özdisan; Height: 2.65mm; MSL: 4; Cost: 0,57; Mounting Type: SMD; Status: Active; Tolerance: N/A; Features: Isolated CAN Transceiver; Supplier URL: https://ozdisan.com/entegre-devreler-icler/interface-entegreleri/driver-receiver-ve-transceiver-entegreleri/ISO1050DUBR/348272
IC7 IC8 = IC_BF_LNDRV_OCTAL_SN74HCT244PWR: IC-74HCT244 SMD TSSOP20; Manufacturer: Texas Instruments; Temp# Operating: -40°C/+85°C; Lead Status: ROHS3 Compliant; Max Reflow Duration: 10s; Max Reflow Temp: 260C; Voltage: -0V5 to 7V; Current: 35mA; Temp# Storage: -65°C/+150°C; Identifier: IC_BF_LNDRV_OCTAL_SN74HCT244PWR; Component Type: Buffer; Distributor: Özdisan; Height: 1.2mm; MSL: 1; Cost: 0,43; Mounting Type: SMD; Package: TSSOP20; Status: Active; Tolerance: N/A; Features: Octal Buffer/Line Driver; Supplier URL: https://ozdisan.com/Product/Detail/474360/SN74HCT244PWR
L1 = IND_22UH_1.44A_SMD_NR6028: INDUCTOR POWER 22UH 6X6MM 1.44A SMD; Manufacturer PN: NR6028-220M; Manufacturer: Core Master; Tolerance: ±20%; Lead Status: ROHS3 Compliant; Package: N/A; Identifier: IND_22UH_1.44A_SMD_NR6028; Component Type: Inductor; Distributor: Özdisan; Height: 2.8mm; Temp# Operating: N/A; Temp# Storage: N/A; MSL: 1; Cost: 0,16000; Features: Shielded, Ferrite; Mounting Type: SMD; Status: Active; Supplier URL: https://ozdisan.com/pasif-komponentler/induktorler/sabit-induktorler/NR6028-220M/529364
LED1-LED4 = LED_RED_0805_1.9V_30mA: LED SMD 0805 RED 110mcd 120° WATER CLEAR; Manufacturer: HONGLITRONIC; Manufacturer PN: HL-PSC-2012S9AC; Lead Status: ROHS Compliant; Temp# Operating: -40°C/+85°C; Temp# Storage: -40°C/+100°C; Max Reflow Duration: 10s; Max Reflow Temp: 260C; Identifier: LED_RED_0805_1.9V_30mA; Component Type: LED; Distributor: Özdisan; Status: Active; Height: 0,68mm; Cost: 0,014; MSL: 4; Mounting Type: SMD; Features: Red; Supplier URL: https://ozdisan.com/led-ve-aydinlatma-cozumleri/led-komponentler/sinyal-ledler-renkli/HL-PSC-2012S9AC/471650
LOGO1 = HCD_LOGO_V1: Hamit Can Dinç LOGO; Identifier: HCD_LOGO_V1; Component Type: LOGO
MDL1 = DCDC_MODULE_R1SX-0505-R: DC/DC CONV 1W 5VDC 5VDC 200mA Op Fr; Manufacturer: Recom Power; Voltage: ADJ; Lead Status: ROHS3 Compliant; Temp# Operating: -40°C/+100°C; Temp# Storage: -55°C/+125°C; Identifier: DCDC_MODULE_R1SX-0505-R; Component Type: DCDC Module; Distributor: Özdisan; Status: Active; Current: 200mA; Package: NaN Standard; Height: 5.8mm; Cost: 4,38; MSL: 1; Mounting Type: SMD; Supplier URL: https://ozdisan.com/guc-kaynaklari/donusturucu-moduller/dcdc-donusturuculer/R1SX-0505-R/538521
R1 = RES_33K_0805_0.125W_±1%: 33 kOhms ±1% 0.25W, 1/4W Chip Resistor 0805 (2012 Metric) Automotive AEC-Q200 Thick Film; Manufacturer: KOA Speer Electronics, Inc.; Manufacturer PN: RK73H2ATTD3302F; Lead Status: RoHS3 Compliant; Power: 0,125W; Temp# Operating: -55°C/+155°C; Max Reflow Duration: 10s; Max Reflow Temp: 260C; Identifier: RES_33K_0805_0.125W_±1%; Component Type: Resistor; Distributor: Digikey; Height: 0,60mm; MSL: 1; Mounting Type: SMD; Status: Active; Voltage: N/A; Current: N/A; Cost: 0,1; Temp# Storage: -55°C/+155°C; Features: Automotive AEC-Q200, ±100ppm/°C; Supplier URL: https://www.digikey.com/en/products/detail/koa-speer-electronics-inc/RK73H2ATTD3302F/10234099
R2 = RES_680R_0805_0.125W_±1%: 680 Ohms ±1% 0.25W, 1/4W Chip Resistor 0805 (2012 Metric) Automotive AEC-Q200 Thick Film; Manufacturer: Rohm Semiconductor; Manufacturer PN: MCR10SEQPF6800; Lead Status: RoHS3 Compliant; Power: 0,125W; Temp# Operating: -55°C/+155°C; Max Reflow Duration: 10s; Max Reflow Temp: 260C; Identifier: RES_680R_0805_0.125W_±1%; Component Type: Resistor; Distributor: Digikey; Height: 0,60mm; MSL: 1; Mounting Type: SMD; Status: Active; Voltage: N/A; Current: N/A; Cost: 0,1; Temp# Storage: -55°C/+155°C; Features: Automotive AEC-Q200, ±100ppm/°C; Supplier URL: https://www.digikey.com/en/products/detail/rohm-semiconductor/MCR10SEQPF6800/26827677
R3 = RES_150K_0805_0.125W_±1%: 150 kOhms ±1% 0.125W, 1/8W Chip Resistor 0805 (2012 Metric) Moisture Resistant Thick Film; Manufacturer: YAGEO; Manufacturer PN: RC0805FR-07150KL; Lead Status: RoHS3 Compliant; Power: 0,125W; Temp# Operating: -55°C/+155°C; Max Reflow Duration: 10s; Max Reflow Temp: 260C; Identifier: RES_150K_0805_0.125W_±1%; Component Type: Resistor; Distributor: Digikey; Height: 0,60mm; MSL: 1; Mounting Type: SMD; Status: Active; Voltage: N/A; Current: N/A; Cost: 0,1; Temp# Storage: -55°C/+155°C; Features: Moisture Resistant; Supplier URL: https://www.digikey.com/en/products/detail/yageo/RC0805FR-07150KL/727614
R4 = RES_12K_0805_0.125W_±1%: 12 kOhms ±1% 0.25W, 1/4W Chip Resistor 0805 (2012 Metric) Anti-Sulfur, Automotive AEC-Q200, Moisture Resistant Thick Film; Manufacturer: KOA Speer Electronics, Inc.; Manufacturer PN: RK73H2ARTTD1202F; Lead Status: RoHS3 Compliant; Power: 0,125W; Temp# Operating: -55°C/+155°C; Max Reflow Duration: 10s; Max Reflow Temp: 260C; Identifier: RES_12K_0805_0.125W_±1%; Component Type: Resistor; Distributor: Digikey; Height: 0,60mm; MSL: 1; Mounting Type: SMD; Status: Active; Voltage: N/A; Current: N/A; Cost: 0,17; Temp# Storage: -55°C/+155°C; Features: Anti-Sulfur, Automotive AEC-Q200, Moisture Resistant, ±100ppm/°C; Supplier URL: https://www.digikey.com/en/products/detail/koa-speer-electronics-inc/RK73H2ARTTD1202F/12548617
R5 = RES_0R_0805_0.125W_±1%: 0 Ohms Jumper Chip Resistor 0805 (2012 Metric) Moisture Resistant Thick Film; Manufacturer: YAGEO; Manufacturer PN: RC0805FR-070RL; Lead Status: RoHS3 Compliant; Power: 0,125W; Temp# Operating: -55°C/+155°C; Max Reflow Duration: 10s; Max Reflow Temp: 260C; Identifier: RES_0R_0805_0.125W_±1%; Component Type: Resistor; Distributor: Digikey; Height: 0,60mm; MSL: 1; Mounting Type: SMD; Status: Active; Voltage: N/A; Current: N/A; Cost: 0,1; Temp# Storage: -55°C/+155°C; Features: Moisture Resistant; Supplier URL: https://www.digikey.com/en/products/detail/yageo/RC0805FR-070RL/2827620
R6 = RES_330K_0805_0.125W_±1%: 330 kOhms ±1% 0.125W, 1/8W Chip Resistor 0805 (2012 Metric) Moisture Resistant Thick Film; Manufacturer: YAGEO; Manufacturer PN: RC0805FR-07330KL; Lead Status: RoHS3 Compliant; Power: 0,125W; Temp# Operating: -55°C/+155°C; Max Reflow Duration: 10s; Max Reflow Temp: 260C; Identifier: RES_330K_0805_0.125W_±1%; Component Type: Resistor; Distributor: Digikey; Height: 0,60mm; MSL: 1; Mounting Type: SMD; Status: Active; Voltage: N/A; Current: N/A; Cost: 0,1; Temp# Storage: -55°C/+155°C; Features: Moisture Resistant; Supplier URL: https://www.digikey.com/en/products/detail/yageo/RC0805FR-07330KL/727867
R7 = RES_5K6_0805_0.125W_±1%: 5.6 kOhms ±1% 0.25W, 1/4W Chip Resistor 0805 (2012 Metric) Automotive AEC-Q200 Thick Film; Manufacturer: Rohm Semiconductor; Manufacturer PN: MCR10SEQPF5601; Lead Status: RoHS3 Compliant; Power: 0,125W; Temp# Operating: -55°C/+155°C; Max Reflow Duration: 10s; Max Reflow Temp: 260C; Identifier: RES_5K6_0805_0.125W_±1%; Component Type: Resistor; Distributor: Digikey; Height: 0,60mm; MSL: 1; Mounting Type: SMD; Status: Active; Voltage: N/A; Current: N/A; Cost: 0,1; Temp# Storage: -55°C/+155°C; Features: Automotive AEC-Q200, ±100ppm/°C; Supplier URL: https://www.digikey.com/en/products/detail/rohm-semiconductor/MCR10SEQPF5601/26827746
R8 = RES_22K_0805_0.125W_±1%: 22 kOhms ±1% 0.25W, 1/4W Chip Resistor 0805 (2012 Metric) Automotive AEC-Q200 Thick Film; Manufacturer: Rohm Semiconductor; Manufacturer PN: MCR10SEQPF2202; Lead Status: RoHS3 Compliant; Power: 0,125W; Temp# Operating: -55°C/+155°C; Max Reflow Duration: 10s; Max Reflow Temp: 260C; Identifier: RES_22K_0805_0.125W_±1%; Component Type: Resistor; Distributor: Digikey; Height: 0,60mm; MSL: 1; Mounting Type: SMD; Status: Active; Voltage: N/A; Current: N/A; Cost: 0,1; Temp# Storage: -55°C/+155°C; Features: Automotive AEC-Q200, ±100ppm/°C; Supplier URL: https://www.digikey.com/en/products/detail/rohm-semiconductor/MCR10SEQPF2202/26826746
R9-R11 R13 R18 R22 R32 = RES_10R_0805_0.125W_±1%: 10 Ohms ±1% 0.125W, 1/8W Chip Resistor 0805 (2012 Metric) Moisture Resistant Thick Film; Manufacturer: YAGEO; Manufacturer PN: RC0805FR-0710RL; Lead Status: RoHS3 Compliant; Power: 0,125W; Temp# Operating: -55°C/+155°C; Max Reflow Duration: 10s; Max Reflow Temp: 260C; Identifier: RES_10R_0805_0.125W_±1%; Component Type: Resistor; Distributor: Digikey; Height: 0,60mm; MSL: 1; Mounting Type: SMD; Status: Active; Voltage: N/A; Current: N/A; Cost: 0,1; Temp# Storage: -55°C/+155°C; Features: Moisture Resistant; Supplier URL: https://www.digikey.com/en/products/detail/yageo/RC0805FR-0710RL/727534
R12 R14 R16 R20 R21 R23 R24 R33 = RES_4K7_0805_0.125W_±1%: 4.7 kOhms ±1% 0.125W, 1/8W Chip Resistor 0805 (2012 Metric) Moisture Resistant Thick Film; Manufacturer: YAGEO; Manufacturer PN: RC0805FR-074K7L; Lead Status: RoHS3 Compliant; Power: 0,125W; Temp# Operating: -55°C/+155°C; Max Reflow Duration: 10s; Max Reflow Temp: 260C; Identifier: RES_4K7_0805_0.125W_±1%; Component Type: Resistor; Distributor: Digikey; Height: 0,60mm; MSL: 1; Mounting Type: SMD; Status: Active; Voltage: N/A; Current: N/A; Cost: 0,1; Temp# Storage: -55°C/+155°C; Features: Moisture Resistant; Supplier URL: https://www.digikey.com/en/products/detail/yageo/RC0805FR-074K7L/727929
R15 = RES_5K1_0805_0.125W_±1%: 5.1 kOhms ±1% 0.25W, 1/4W Chip Resistor 0805 (2012 Metric) Moisture Resistant Thick Film; Manufacturer: YAGEO; Manufacturer PN: RC0805FR-7W5K1L; Lead Status: RoHS3 Compliant; Power: 0,125W; Temp# Operating: -55°C/+155°C; Max Reflow Duration: 10s; Max Reflow Temp: 260C; Identifier: RES_5K1_0805_0.125W_±1%; Component Type: Resistor; Distributor: Digikey; Height: 0,60mm; MSL: 1; Mounting Type: SMD; Status: Active; Voltage: N/A; Current: N/A; Cost: 0,12; Temp# Storage: -55°C/+155°C; Features: Moisture Resistant, ±200ppm/°C; Supplier URL: https://www.digikey.com/en/products/detail/yageo/RC0805FR-7W5K1L/17027637
R17 = RES_120R_0805_0.125W_±1%: 120 Ohms ±1% 0.25W, 1/4W Chip Resistor 0805 (2012 Metric) Moisture Resistant Thick Film; Manufacturer: YAGEO; Manufacturer PN: RC0805FR-7W120RL; Lead Status: RoHS3 Compliant; Power: 0,125W; Temp# Operating: -55°C/+155°C; Max Reflow Duration: 10s; Max Reflow Temp: 260C; Identifier: RES_120R_0805_0.125W_±1%; Component Type: Resistor; Distributor: Digikey; Height: 0,60mm; MSL: 1; Mounting Type: SMD; Status: Active; Voltage: N/A; Current: N/A; Cost: 0,16; Temp# Storage: -55°C/+155°C; Features: Moisture Resistant, ±200ppm/°C; Supplier URL: https://www.digikey.com/en/products/detail/yageo/RC0805FR-7W120RL/17019563
R19 = RES_330R_0805_0.125W_±1%: 330 Ohms ±1% 0.25W, 1/4W Chip Resistor 0805 (2012 Metric) Moisture Resistant Thick Film; Manufacturer: YAGEO; Manufacturer PN: RC0805FR-7W330RL; Lead Status: RoHS3 Compliant; Power: 0,125W; Temp# Operating: -55°C/+155°C; Max Reflow Duration: 10s; Max Reflow Temp: 260C; Identifier: RES_330R_0805_0.125W_±1%; Component Type: Resistor; Distributor: Digikey; Height: 0,60mm; MSL: 1; Mounting Type: SMD; Status: Active; Voltage: N/A; Current: N/A; Cost: 0,12; Temp# Storage: -55°C/+155°C; Features: Moisture Resistant, ±200ppm/°C; Supplier URL: https://www.digikey.com/en/products/detail/yageo/RC0805FR-7W330RL/12698865
R25 R31 = RES_62R_0805_0.125W_±1%: 62 Ohms ±1% 0.25W, 1/4W Chip Resistor 0805 (2012 Metric) Automotive AEC-Q200, Moisture Resistant Thick Film; Manufacturer: YAGEO; Manufacturer PN: AC0805FR-7W62RL; Lead Status: RoHS3 Compliant; Power: 0,125W; Temp# Operating: -55°C/+155°C; Max Reflow Duration: 10s; Max Reflow Temp: 260C; Identifier: RES_62R_0805_0.125W_±1%; Component Type: Resistor; Distributor: Digikey; Height: 0,60mm; MSL: 1; Mounting Type: SMD; Status: Active; Voltage: N/A; Current: N/A; Cost: 0,11; Temp# Storage: -55°C/+155°C; Features: Automotive AEC-Q200, Moisture Resistant, ±100ppm/°C; Supplier URL: https://www.digikey.com/en/products/detail/yageo/AC0805FR-7W62RL/17009273
R26 = RES_2K2_0805_0.125W_±1%: 2.2 kOhms ±1% 0.25W, 1/4W Chip Resistor 0805 (2012 Metric) Automotive AEC-Q200, Moisture Resistant Thick Film; Manufacturer: YAGEO; Manufacturer PN: AC0805FR-7W2K2L; Lead Status: RoHS3 Compliant; Power: 0,125W; Temp# Operating: -55°C/+155°C; Max Reflow Duration: 10s; Max Reflow Temp: 260C; Identifier: RES_2K2_0805_0.125W_±1%; Component Type: Resistor; Distributor: Digikey; Height: 0,60mm; MSL: 1; Mounting Type: SMD; Status: Active; Voltage: N/A; Current: N/A; Cost: 0,1; Temp# Storage: -55°C/+155°C; Features: Automotive AEC-Q200, Moisture Resistant, ±100ppm/°C; Supplier URL: https://www.digikey.com/en/products/detail/yageo/AC0805FR-7W2K2L/16991582
R28-R30 = RES_1K_0805_0.125W_±1%: 1 kOhms ±1% 0.125W, 1/8W Chip Resistor 0805 (2012 Metric) Moisture Resistant Thick Film; Manufacturer: YAGEO; Manufacturer PN: RC0805FR-071KL; Lead Status: RoHS3 Compliant; Power: 0,125W; Temp# Operating: -55°C/+155°C; Max Reflow Duration: 10s; Max Reflow Temp: 260C; Identifier: RES_1K_0805_0.125W_±1%; Component Type: Resistor; Distributor: Digikey; Height: 0,60mm; MSL: 1; Mounting Type: SMD; Status: Active; Voltage: N/A; Current: N/A; Cost: 0,1; Temp# Storage: -55°C/+155°C; Features: Moisture Resistant; Supplier URL: https://www.digikey.com/en/products/detail/yageo/RC0805FR-071KL/727444
SW1 = BUTTON_TACT_2PIN_DTSM-31R-V-T/R: SWITCH TACT 6.00x3.50 4.30mm 260gF SMT V/T; Manufacturer PN: DTSMF-31R-V-T/R; Manufacturer: DIPTRONICS; Voltage: 12V; Current: 50mA; Temp# Operating: -25°C ~ 70°C; Lead Status: ROHS3 Compliant; Max Reflow Duration: 10s; Max Reflow Temp: 260C; Identifier: BUTTON_TACT_2PIN_DTSM-31R-V-T/R; Component Type: Switch; Distributor: Özdisan; Height: 5mm; Temp# Storage: N/A; MSL: 1; Features: tact button 2 pın; Mounting Type: SMD; Supplier URL: https://www.ozdisan.com/elektromekanik-komponentler/sivicler-ve-anahtarlar/tact-sivicler/DTSMF-31R-V-TR/354235
TP1-TP5 = TP_SMD_CIRC_D1.0: SMD CIRC Test Point 1mm; Identifier: TP_SMD_CIRC_D1.0; Component Type: Test Point; Distributor: N/A; Lead Status: N/A; MSL: N/A; Features: N/A; Mounting Type: SMD; Package: TP_SMD_CIRC_D1.0
TVS1 = TVS_33,3V_UNIDIR_DO214AC_P4SMAJ30AS_R1_00001: DIODE TVS 400W 30V SMA; Manufacturer: PANJIT; Temp# Operating: -55°C/+150°C; Lead Status: RoHS2 Compliant; Max Reflow Duration: 10s; Max Reflow Temp: 260C; Value: value; Identifier: TVS_33,3V_UNIDIR_DO214AC_P4SMAJ30AS_R1_00001; Component Type: TVS; Distributor: Özdisan; Manufacturer PN: P4SMAJ30AS_R1_00001; Height: 2,44mm; Temp# Storage: -55°C/+150°C; MSL: 1; Cost: 0,077; Mounting Type: SMD; Status: Active; Supplier URL: https://ozdisan.com/guc-yari-iletkenleri/diyotlar-modul-diyotlar-ve-dogrultucular/tvs-diyotlar/P4SMAJ30ASR100001/642901